# Altium project Atari_Controller.PrjPcb
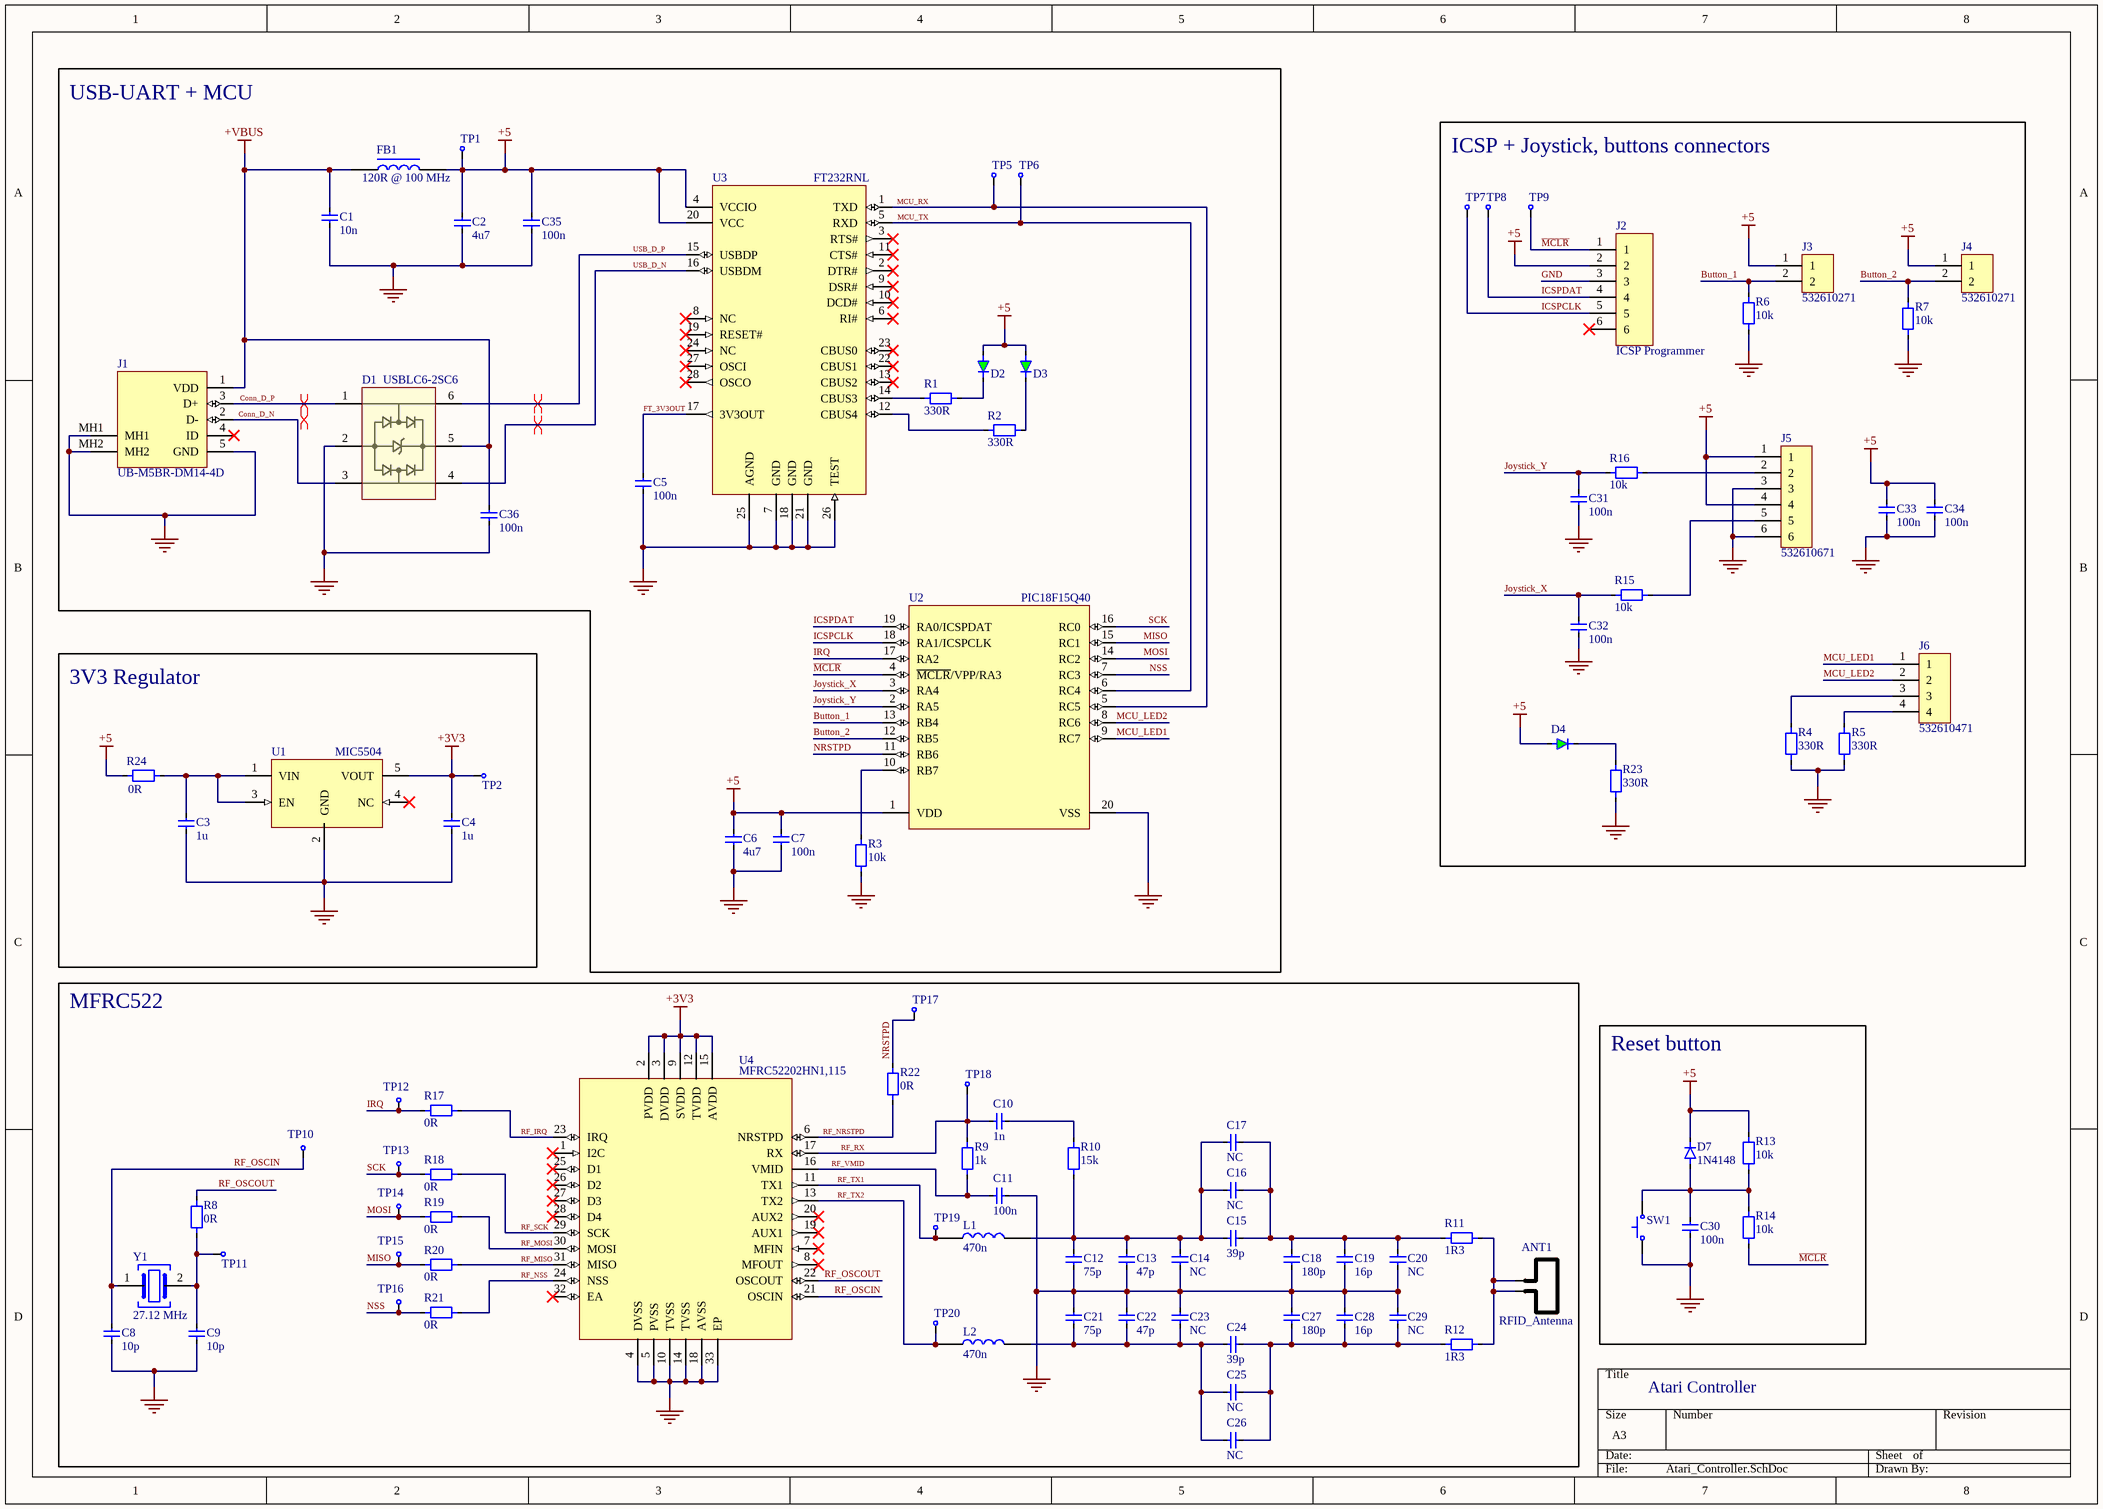
[diagram p0: Atari_Controller.SchDoc]
1 sheet, 99 parts. Net scope: global (net labels, ports and power ports of the same name join across sheets).
Board file: Atari_Controller.PcbDoc

## Sheet Atari_Controller.SchDoc
size A3; SheetNumber: 1; SheetTotal: 1

### Parts
ANT1  RFID_Antenna  [RFID_Antenna]
C1  10n  [CAP_0603]
C2  4u7  [CAP_0603]
C3  1u  [CAP_0603]
C4  1u  [CAP_0603]
C5  100n  [CAP_0603]
C6  4u7  [CAP_0603]
C7  100n  [CAP_0603]
C8  10p  [CAP_0603]
C9  10p  [CAP_0603]
C10  1n  [CAP_0603]
C11  100n  [CAP_0603]
C12  75p  [CAP_0603]
C13  47p  [CAP_0603]
C14  NC  [CAP_0603]
C15  39p  [CAP_0603]
C16  NC  [CAP_0603]
C17  NC  [CAP_0603]
C18  180p  [CAP_0603]
C19  16p  [CAP_0603]
C20  NC  [CAP_0603]
C21  75p  [CAP_0603]
C22  47p  [CAP_0603]
C23  NC  [CAP_0603]
C24  39p  [CAP_0603]
C25  NC  [CAP_0603]
C26  NC  [CAP_0603]
C27  180p  [CAP_0603]
C28  16p  [CAP_0603]
C29  NC  [CAP_0603]
C30  100n  [CAP_0603]
C31  100n  [CAP_0603]
C32  100n  [CAP_0603]
C33  100n  [CAP_0603]
C34  100n  [CAP_0603]
C35  100n  [CAP_0603]
C36  100n  [CAP_0603]
D1  USBLC6-2SC6  [SOT-666]
D2  SMD-GREEN  [LED_0603]  (value not drawn)
D3  SMD-GREEN  [LED_0603]  (value not drawn)
D4  SMD-RED  [LED_0603]  (value not drawn)
D7  1N4148  [1N4148]
FB1  120R @ 100 MHz  [Ferrite_Bead_0603]
J1  UB-M5BR-DM14-4D  [USB-B-MINI]
J2  ICSP Programmer  [6_pin_2.54]
J3  532610271  [Molex_Picoblade_2pin]
J4  532610271  [Molex_Picoblade_2pin]
J5  532610671  [Molex_Picoblade_6pin]
J6  532610471  [MOLEX_PICOBLADE_4Pin]
L1  470n  [IND_0603]
L2  470n  [IND_0603]
R1  330R  [RES_0603]
R2  330R  [RES_0603]
R3  10k  [RES_0603]
R4  330R  [RES_0603]
R5  330R  [RES_0603]
R6  10k  [RES_0603]
R7  10k  [RES_0603]
R8  0R  [RES_0603]
R9  1k  [RES_0603]
R10  15k  [RES_0603]
R11  1R3  [RES_0603]
R12  1R3  [RES_0603]
R13  10k  [RES_0603]
R14  10k  [RES_0603]
R15  10k  [RES_0603]
R16  10k  [RES_0603]
R17  0R  [RES_0603]
R18  0R  [RES_0603]
R19  0R  [RES_0603]
R20  0R  [RES_0603]
R21  0R  [RES_0603]
R22  0R  [RES_0603]
R23  330R  [RES_0603]
R24  0R  [RES_0603]
SW1  SPST_Switch  [Tactile_Switch_4.5x4.5]  (value not drawn)
TP1  TestPoint  [Pad_2.5mm]  (value not drawn)
TP2  TestPoint  [Pad_2.5mm]  (value not drawn)
TP5  TestPoint  [Pad_2.5mm]  (value not drawn)
TP6  TestPoint  [Pad_2.5mm]  (value not drawn)
TP7  TestPoint  [Pad_2.5mm]  (value not drawn)
TP8  TestPoint  [Pad_2.5mm]  (value not drawn)
TP9  TestPoint  [Pad_2.5mm]  (value not drawn)
TP10  TestPoint  [Pad_2.5mm]  (value not drawn)
TP11  TestPoint  [Pad_2.5mm]  (value not drawn)
TP12  TestPoint  [Pad_2.5mm]  (value not drawn)
TP13  TestPoint  [Pad_2.5mm]  (value not drawn)
TP14  TestPoint  [Pad_2.5mm]  (value not drawn)
TP15  TestPoint  [Pad_2.5mm]  (value not drawn)
TP16  TestPoint  [Pad_2.5mm]  (value not drawn)
TP17  TestPoint  [Pad_2.5mm]  (value not drawn)
TP18  TestPoint  [Pad_2.5mm]  (value not drawn)
TP19  TestPoint  [Pad_2.5mm]  (value not drawn)
TP20  TestPoint  [Pad_2.5mm]  (value not drawn)
U1  MIC5504  [SOT-23-5]
U2  PIC18F15Q40  [SOP20]
U3  FT232RNL  [SOP65P780X200-28N]
U4  MFRC52202HN1,115  [PQFN50P500X500X100_HS-33N]
Y1  27.12 MHz  [CrystalOscillator]

### Blocks framed on the sheet
USB-UART + MCU: C1 C2 C5-C7 C35 C36 D1-D3 FB1 J1 R1-R3 TP1 TP5 TP6 U2 U3
ICSP + Joystick, buttons connectors: C31-C34 D4 J2-J6 R4-R7 R15 R16 R23 TP7-TP9
3V3 Regulator: C3 C4 R24 TP2 U1
MFRC522: ANT1 C8-C29 L1 L2 R8-R12 R17-R22 TP10-TP20 U4 Y1
Reset button: C30 D7 R13 R14 SW1

### Nets
+3V3: C4.2 TP2.1 U1.5(VOUT) U4.2(PVDD) U4.3(DVDD) U4.9(SVDD) U4.12(TVDD) U4.15(AVDD)
+5: C2.2 C6.2 C7.2 C33.2 C34.2 C35.2 D2.2 D3.2 D4.2 D7.1 FB1.2 J2.2 J3.1 J4.1 J5.1 J5.4 R13.2 R24.1 TP1.1 U2.1(VDD) U3.4(VCCIO) U3.20(VCC)
+VBUS: C1.2 C36.2 D1.5(VBUS) FB1.1 J1.1(VDD)
GND: C1.1 C2.1 C3.1 C4.1 C5.1 C6.1 C7.1 C8.1 C9.1 C11.2 C12.1 C13.1 C14.1 C18.1 C19.1 C20.1 C21.2 C22.2 C23.2 C27.2 C28.2 C29.2 C30.1 C31.1 C32.1 C33.1 C34.1 C35.1 C36.1 D1.2(GND) J1.5(GND) J1.MH1 J1.MH2 J2.3 J5.3 J5.6 R3.1 R4.1 R5.1 R6.1 R7.1 R23.1 SW1.1 U1.2(GND) U2.20(VSS) U3.7(GND) U3.18(GND) U3.21(GND) U3.25(AGND) U3.26(TEST) U4.4(DVSS) U4.5(PVSS) U4.10(TVSS) U4.14(TVSS) U4.18(AVSS) U4.33(EP)
Button_1: J3.2 R6.2 U2.13(RB4)
Button_2: J4.2 R7.2 U2.12(RB5)
Conn_D_N: D1.3(I/O_2) J1.2(D-)
Conn_D_P: D1.1(I/O_1) J1.3(D+)
FT_3V3OUT: C5.2 U3.17(3V3OUT)
ICSPCLK: J2.5 TP7.1 U2.18(RA1/ICSPCLK)
ICSPDAT: J2.4 TP8.1 U2.19(RA0/ICSPDAT)
IRQ: R17.1 TP12.1 U2.17(RA2)
Joystick_X: C32.2 R15.1 U2.3(RA4)
Joystick_Y: C31.2 R16.1 U2.2(RA5)
~{MCLR}: J2.1 R14.1 TP9.1 U2.4(~{MCLR}/VPP/RA3)
MCU_LED1: J6.1 U2.9(RC7)
MCU_LED2: J6.2 U2.8(RC6)
MCU_RX: TP5.1 U2.5(RC5) U3.1(TXD)
MCU_TX: TP6.1 U2.6(RC4) U3.5(RXD)
MISO: R20.1 TP15.1 U2.15(RC1)
MOSI: R19.1 TP14.1 U2.14(RC2)
NRSTPD: R22.2 TP17.1 U2.11(RB6)
NSS: R21.1 TP16.1 U2.7(RC3)
RF_IRQ: R17.2 U4.23(IRQ)
RF_MISO: R20.2 U4.31(MISO)
RF_MOSI: R19.2 U4.30(MOSI)
RF_NRSTPD: R22.1 U4.6(NRSTPD)
RF_NSS: R21.2 U4.24(NSS)
RF_OSCIN: C8.2 TP10.1 U4.21(OSCIN) Y1.1
RF_OSCOUT: R8.2 U4.22(OSCOUT)
RF_RX: C10.2 R9.2 TP18.1 U4.17(RX)
RF_SCK: R18.2 U4.29(SCK)
RF_TX1: L1.1 TP19.1 U4.11(TX1)
RF_TX2: L2.1 TP20.1 U4.13(TX2)
RF_VMID: C11.1 R9.1 U4.16(VMID)
SCK: R18.1 TP13.1 U2.16(RC0)
USB_D_N: D1.4(I/O_3) U3.16(USBDM)
USB_D_P: D1.6(I/O_4) U3.15(USBDP)
NetANT1_1: ANT1.1 ANT1.2 R11.1 R12.2
NetC3_2: C3.2 R24.2 U1.1(VIN) U1.3(EN)
NetC9_2: C9.2 R8.1 TP11.1 Y1.2
NetC10_1: C10.1 R10.2
NetC12_2: C12.2 C13.2 C14.2 C15.1 C16.1 C17.1 L1.2 R10.1
NetC15_2: C15.2 C16.2 C17.2 C18.2 C19.2 C20.2 R11.2
NetC21_1: C21.1 C22.1 C23.1 C24.1 C25.1 C26.1 L2.2
NetC24_2: C24.2 C25.2 C26.2 C27.1 C28.1 C29.1 R12.1
NetC30_2: C30.2 D7.2 R13.1 R14.2 SW1.2
NetD2_1: D2.1 R1.2
NetD3_1: D3.1 R2.2
NetD4_1: D4.1 R23.2
NetJ5_2: J5.2 R16.2
NetJ5_5: J5.5 R15.2
NetJ6_3: J6.3 R4.2
NetJ6_4: J6.4 R5.2
NetR1_1: R1.1 U3.14(CBUS3)
NetR2_1: R2.1 U3.12(CBUS4)
NetR3_2: R3.2 U2.10(RB7)

Not connected (* = marked no-connect by the designer): J1 4(ID)*; J2 6*; U1 4(NC)*; U3 2(DTR#)* 3(RTS#)* 6(RI#)* 8(NC)* 9(DSR#)* 10(DCD#)* 11(CTS#)* 13(CBUS2)* 19(RESET#)* 22(CBUS1)* 23(CBUS0)* 24(NC)* 27(OSCI)* 28(OSCO)*; U4 1(I2C)* 7(MFIN)* 8(MFOUT)* 19(AUX1)* 20(AUX2)* 25(D1)* 26(D2)* 27(D3)* 28(D4)* 32(EA)*

### Layout directives
differential pair: Conn_D_N, Conn_D_P, USB_D_N, USB_D_P

### Notes on the sheet
- Atari Controller

### Library data of the parts
ANT1 = RFID_Antenna: Matching for MRFC522
C1-C4 C6-C29 C31-C34 C36 = CAP_0603_16V: Capacitor SMD 0603 16V
C5 C30 C35 = CAP_0603_10V: Capacitor SMD 0603 10V
D1 = USBLC6-2SC6: ESD Suppressors / TVS Diodes ESD Protection Low Cap; ComponentLink1Description: TME; ComponentLink1URL: https://www.tme.eu/cz/details/usblc6-2sc6/ochranne-diody-site/stmicroelectronics/; Part ID: USBLC6-2SC6; LINK: https://www.tme.eu/cz/details/usblc6-2sc6/ochranne-diody-site/stmicroelectronics/
D2-D4 = LED_0603: LED SMD 0603; ComponentLink1Description: TME
  D2: ComponentLink1URL: https://www.tme.eu/cz/details/osg50603c1e/diody-led-smd-barevne/optosupply/; Part ID: OSG50603C1E; LINK: https://www.tme.eu/cz/details/osg50603c1e/diody-led-smd-barevne/optosupply/
  D3: Part ID: OSG50603C1E; ComponentLink1URL: https://www.tme.eu/cz/details/osg50603c1e/diody-led-smd-barevne/optosupply/; LINK: https://www.tme.eu/cz/details/osg50603c1e/diody-led-smd-barevne/optosupply/
  D4: ComponentLink1URL: https://www.tme.eu/cz/details/kph-1608id/diody-led-smd-barevne/kingbright-electronic/; Part ID: KPH-1608ID; LINK: https://www.tme.eu/cz/details/kph-1608id/diody-led-smd-barevne/kingbright-electronic/
D7 = 1N4148: THT; 100V; 0,2A; Ifsm: 1A; DO35; Ufmax: 1V; 4ns; ComponentLink1Description: TME; ComponentLink1URL: https://www.tme.eu/cz/details/1n4148-fai/univerzalni-diody-tht/onsemi/1n4148/; Part ID: 1N4148; LINK: https://www.tme.eu/cz/details/1n4148-fai/univerzalni-diody-tht/onsemi/1n4148/
FB1 = FERRITE_BEAD_0603: Ferrite Bead 0603; ComponentLink1Description: TME; ComponentLink1URL: https://www.tme.eu/en/details/blm18pg121sh1d/ferrite-beads/murata/; Part ID: BLM18PG121SH1D; LINK: https://www.tme.eu/en/details/blm18pg121sh1d/ferrite-beads/murata/
J1 = USB-B-MINI: ComponentLink1Description: TME; ComponentLink1URL: https://www.tme.eu/cz/details/ub-m5br-dm14-4d/konektory-usb-a-ieee1394/jst/ub-m5br-dm14-4d-lf-sn-l/; Part ID: UB-M5BR-DM14-4D (LF)(SN)(L); LINK: https://www.tme.eu/cz/details/ub-m5br-dm14-4d/konektory-usb-a-ieee1394/jst/ub-m5br-dm14-4d-lf-sn-l/
J2 = 6-pin header 2.54mm: 6 pin male header 2.54mm
J3 J4 = PicoBlade_2: Zásuvka; kabel-pl.spoj; vidlice; PicoBlade™; 1,25mm; PIN: 2; SMT; 1A; ComponentLink1Description: TME; ComponentLink1URL: https://www.tme.eu/cz/details/mx-53261-0271/signalove-konektory-raster-1-25mm/molex/532610271/; Part ID: 532610271; LINK: https://www.tme.eu/cz/details/mx-53261-0271/signalove-konektory-raster-1-25mm/molex/532610271/
J5 = PicoBlade_6: Zásuvka; kabel-pl.spoj; vidlice; PicoBlade™; 1,25mm; PIN: 6; SMT; 1A; ComponentLink1Description: TME; ComponentLink1URL: https://www.tme.eu/cz/details/mx-53261-0671/signalove-konektory-raster-1-25mm/molex/532610671/; Part ID: 532610671; LINK: https://www.tme.eu/cz/details/mx-53261-0671/signalove-konektory-raster-1-25mm/molex/532610671/
J6 = PicoBlade_4: Zásuvka; kabel-pl.spoj; vidlice; PicoBlade™; 1,25mm; PIN: 4; SMT; 1A; ComponentLink1Description: TME; ComponentLink1URL: https://www.tme.eu/cz/details/mx-53261-0471/signalove-konektory-raster-1-25mm/molex/532610471/; Part ID: 532610471; LINK: https://www.tme.eu/cz/details/mx-53261-0471/signalove-konektory-raster-1-25mm/molex/532610471/
L1 L2 = IND_0603: Inductor 0603 SMD; ComponentLink1Description: Mouser; ComponentLink1URL: https://cz.mouser.com/ProductDetail/TAIYO-YUDEN/LBCNF1608KKTR47MAD?qs=tlsG%2FOw5FFhdrRySDrBNfg%3D%3D; Part ID: LBCNF1608KKTR47MAD; LINK: https://cz.mouser.com/ProductDetail/TAIYO-YUDEN/LBCNF1608KKTR47MAD?qs=tlsG%2FOw5FFhdrRySDrBNfg%3D%3D
R1-R24 = RES_0603: Resistor SMD 0603
SW1 = SPST_Switch: SPST-NO Tactile Switch 4.5x4.5; ComponentLink1Description: TME; ComponentLink1URL: https://www.tme.eu/cz/details/tl3305af160qg/mikrospinace-tact/e-switch/; Part ID: TL3305AF160QG; LINK: https://www.tme.eu/cz/details/tl3305af160qg/mikrospinace-tact/e-switch/
U1 = MIC5504-3.3YM5-TR: LDO regulator 3.3V; ComponentLink1Description: Mouser; ComponentLink1URL: https://cz.mouser.com/ProductDetail/Microchip-Technology/MIC5504-3.3YM5-TR?qs=U6T8BxXiZAUmVQ5Zs217qQ%3D%3D; ComponentLink2Description: Datasheet; ComponentLink2URL: https://cz.mouser.com/datasheet/2/268/MIC550X-1082389.pdf; Part ID: MIC5504-3.3YM5-TR; LINK: https://cz.mouser.com/ProductDetail/Microchip-Technology/MIC5504-3.3YM5-TR?qs=U6T8BxXiZAUmVQ5Zs217qQ%3D%3D
U2 = PIC18F15Q40: PIC18F04/05/14/15Q40 14/20-Pin, Low-Power, High-Performance Microcontroller; ComponentLink1Description: Microchip; ComponentLink1URL: https://www.microchip.com/en-us/product/pic18f15q40; ComponentLink2Description: TME; ComponentLink2URL: https://www.tme.eu/cz/details/pic18f15q40-i_so/rodina-pic-8-bitu/microchip-technology/; Part ID: PIC18F15Q40-I/SO; LINK: https://www.tme.eu/cz/details/pic18f15q40-i_so/rodina-pic-8-bitu/microchip-technology/
U3 = FT232RNL: USB Interface IC USB Full Speed to Serial UART IC, Includes Oscillator and EEPROM, SSOP-28; ComponentLink1Description: TME; ComponentLink1URL: https://www.tme.eu/cz/details/ft232rnl/integrovane-obvody-interface-usb/ftdi/ft232rnl-reel/; Part ID: FT232RNL-REEL; LINK: https://www.tme.eu/cz/details/ft232rnl/integrovane-obvody-interface-usb/ftdi/ft232rnl-reel/
U4 = MFRC52202HN1,115: NFC/RFID Tags & Transponders Standard performance MIFARE and NTAG frontend; ComponentLink1Description: Mouser; ComponentLink1URL: https://cz.mouser.com/ProductDetail/NXP-Semiconductors/MFRC52202HN1115?qs=cbprxTG2Yq%2F%252BkR%2FEgMbBLA%3D%3D; Part ID: MFRC52202HN1,115; LINK: https://cz.mouser.com/ProductDetail/NXP-Semiconductors/MFRC52202HN1115?qs=cbprxTG2Yq%2F%252BkR%2FEgMbBLA%3D%3D
Y1 = Crystal_Oscillator: Crystal oscillator; ComponentLink1Description: Mouser; ComponentLink1URL: https://cz.mouser.com/ProductDetail/IQD/LFXTAL036075Bulk?qs=e4%2FAndAAwgJjgKMHylwuSw%3D%3D; Part ID: LFXTAL036075Bulk; LINK: https://cz.mouser.com/ProductDetail/IQD/LFXTAL036075Bulk?qs=e4%2FAndAAwgJjgKMHylwuSw%3D%3D